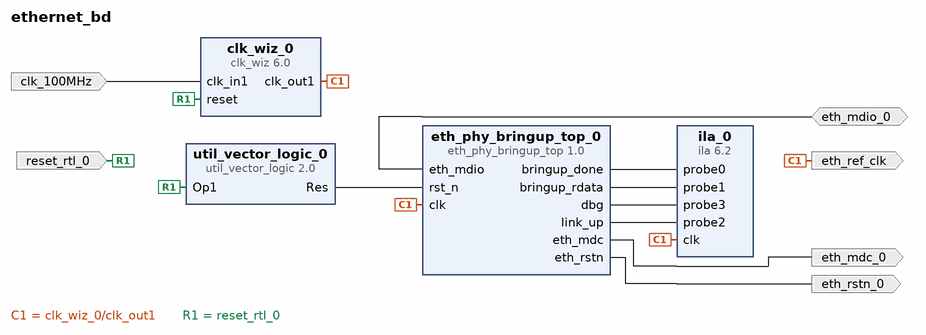
[diagram p0: block diagram of the top level]
# Vivado block design ethernet_bd, xc7a35ticsg324-1L, Vivado 2025.2
create_bd_design ethernet_bd

create_bd_port -dir I -type rst reset_rtl_0
set_property -dict {CONFIG.POLARITY ACTIVE_HIGH} [get_bd_ports reset_rtl_0]
create_bd_port -dir I -type clk clk_100MHz
create_bd_port -dir O -type rst eth_rstn_0
create_bd_port -dir O eth_mdc_0
create_bd_port -dir IO eth_mdio_0
create_bd_port -dir O -type clk eth_ref_clk

create_bd_cell -type ip -vlnv xilinx.com:ip:clk_wiz:6.0 clk_wiz_0
set_property -dict [list \
  CONFIG.CLKOUT1_JITTER 181.828 \
  CONFIG.CLKOUT1_PHASE_ERROR 104.359 \
  CONFIG.CLKOUT1_REQUESTED_OUT_FREQ 25 \
  CONFIG.MMCM_CLKFBOUT_MULT_F 9.125 \
  CONFIG.MMCM_CLKOUT0_DIVIDE_F 36.500 \
  CONFIG.MMCM_DIVCLK_DIVIDE 1 \
] [get_bd_cells clk_wiz_0]
create_bd_cell -type ip -vlnv xilinx.com:ip:util_vector_logic:2.0 util_vector_logic_0
set_property -dict {CONFIG.C_OPERATION not CONFIG.C_SIZE 1} [get_bd_cells util_vector_logic_0]
create_bd_cell -type ip -vlnv xilinx.com:ip:ila:6.2 ila_0
set_property -dict [list \
  CONFIG.C_DATA_DEPTH 16384 \
  CONFIG.C_MONITOR_TYPE Native \
  CONFIG.C_NUM_OF_PROBES 4 \
  CONFIG.C_PROBE1_WIDTH 16 \
  CONFIG.C_PROBE3_WIDTH 16 \
] [get_bd_cells ila_0]
create_bd_cell -type ip -vlnv xilinx.com:user:eth_phy_bringup_top:1.0 eth_phy_bringup_top_0

# ---- connections ----

connect_bd_net [get_bd_ports eth_mdio_0] [get_bd_pins eth_phy_bringup_top_0/eth_mdio]
connect_bd_net -net clk_in1_0_1 [get_bd_ports clk_100MHz] [get_bd_pins clk_wiz_0/clk_in1]
connect_bd_net [get_bd_pins clk_wiz_0/clk_out1] [get_bd_ports eth_ref_clk] [get_bd_pins ila_0/clk] [get_bd_pins eth_phy_bringup_top_0/clk]
connect_bd_net [get_bd_pins eth_phy_bringup_top_0/bringup_done] [get_bd_pins ila_0/probe0]
connect_bd_net [get_bd_pins eth_phy_bringup_top_0/bringup_rdata] [get_bd_pins ila_0/probe1]
connect_bd_net [get_bd_pins eth_phy_bringup_top_0/dbg] [get_bd_pins ila_0/probe3]
connect_bd_net [get_bd_pins eth_phy_bringup_top_0/eth_mdc] [get_bd_ports eth_mdc_0]
connect_bd_net [get_bd_pins eth_phy_bringup_top_0/eth_rstn] [get_bd_ports eth_rstn_0]
connect_bd_net [get_bd_pins eth_phy_bringup_top_0/link_up] [get_bd_pins ila_0/probe2]
connect_bd_net -net reset_0_1 [get_bd_ports reset_rtl_0] [get_bd_pins clk_wiz_0/reset] [get_bd_pins util_vector_logic_0/Op1]
connect_bd_net [get_bd_pins util_vector_logic_0/Res] [get_bd_pins eth_phy_bringup_top_0/rst_n]

validate_bd_design
save_bd_design
